# Altium schematic sheet Main_Scheet.SchDoc: Main sheet
size 420 x 297 mm; DocumentNumber: 2; SheetNumber: 2; SheetTotal: 8
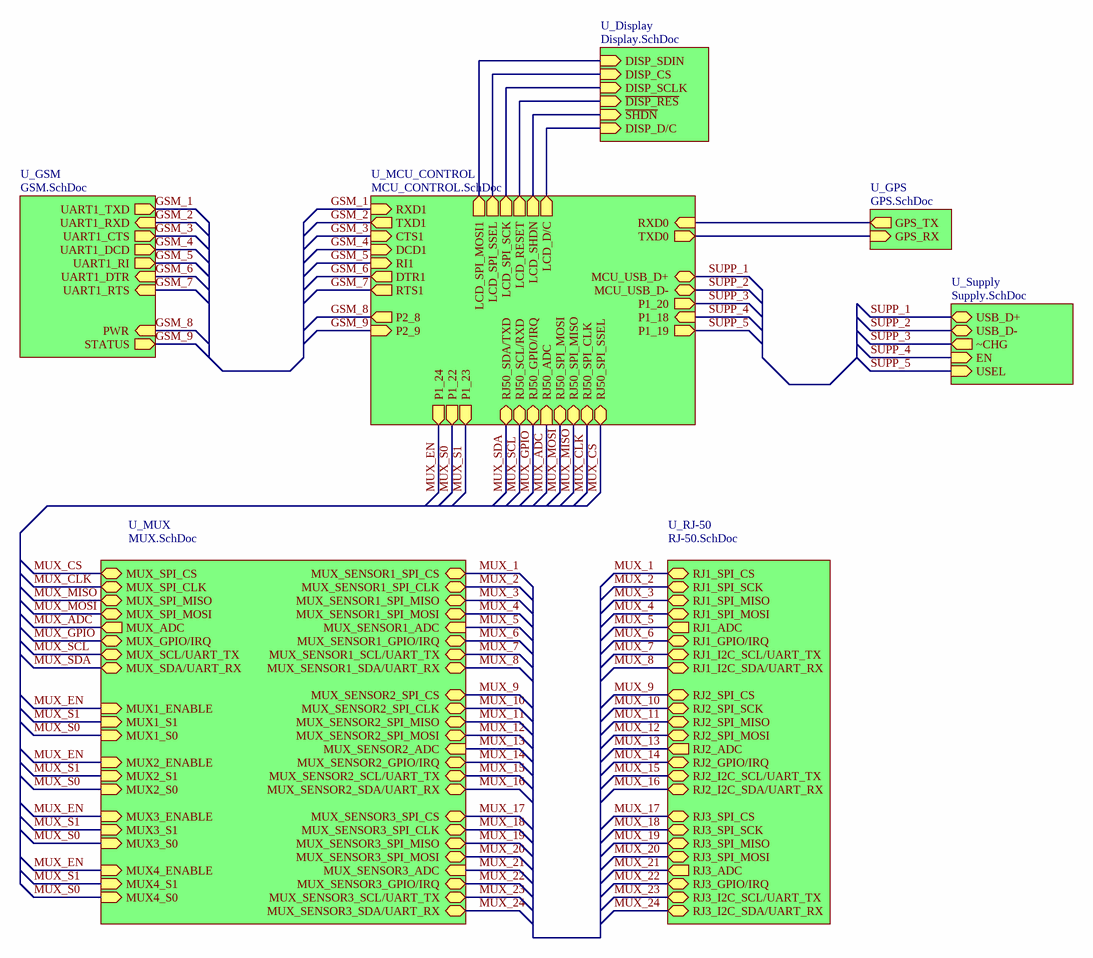
[diagram p0: Main_Scheet.SchDoc]

## Sub-sheets
U_Display = Display.SchDoc: ~{SHDN} (in), DISP_CS (in), ~{DISP_RES} (in), DISP_D/C (in), DISP_SCLK (in), DISP_SDIN (in)
U_GPS = GPS.SchDoc: GPS_RX (in), GPS_TX (out)
U_GSM = GSM.SchDoc: UART1_DCD (out), UART1_TXD (out), UART1_DTR (in), UART1_RI (out), UART1_RTS (in), UART1_RXD (in), UART1_CTS (out), STATUS (out), PWR (in)
U_MCU_CONTROL = MCU_CONTROL.SchDoc: TXD1 (out), RXD1 (in), CTS1 (in), DCD1 (in), DTR1 (out), RI1 (in), RTS1 (out), RXD0 (in), TXD0 (out), MCU_USB_D+ (bidir), MCU_USB_D- (bidir), P2_8 (out), RJ50_SPI_SSEL (bidir), P1_18 (in), P1_19 (out), P1_20 (out), RJ50_SCL/RXD (bidir), RJ50_SDA/TXD (bidir), RJ50_SPI_CLK (bidir), RJ50_SPI_MISO (bidir), RJ50_SPI_MOSI (bidir), RJ50_GPIO/IRQ (bidir), RJ50_ADC (in), P1_22 (out), P1_23 (out), P1_24 (out), P2_9 (in), LCD_D/C (out), LCD_RESET (out), LCD_SPI_SSEL (out), LCD_SPI_MOSI1 (out), LCD_SHDN (out), LCD_SPI_SCK (out)
U_MUX = MUX.SchDoc: MUX_SPI_CS (bidir), MUX_SENSOR1_SPI_CS (bidir), MUX_SENSOR2_SPI_CS (bidir), MUX_SENSOR3_SPI_CS (bidir), MUX_SENSOR1_SPI_CLK (bidir), MUX_SENSOR2_SPI_CLK (bidir), MUX_SENSOR3_SPI_CLK (bidir), MUX_SPI_CLK (bidir), MUX1_ENABLE (in), MUX1_S1 (in), MUX1_S0 (in), MUX_SPI_MISO (bidir), MUX_SENSOR1_SPI_MISO (bidir), MUX_SENSOR2_SPI_MISO (bidir), MUX_SENSOR3_SPI_MISO (bidir), MUX_SENSOR1_SPI_MOSI (bidir), MUX_SENSOR2_SPI_MOSI (bidir), MUX_SENSOR3_SPI_MOSI (bidir), MUX_SPI_MOSI (bidir), MUX2_ENABLE (in), MUX2_S1 (in), MUX2_S0 (in), MUX_ADC (out), MUX_SENSOR1_ADC (in), MUX_SENSOR2_ADC (in), MUX_SENSOR3_ADC (in), MUX_SENSOR1_GPIO/IRQ (bidir), MUX_SENSOR2_GPIO/IRQ (bidir), MUX_SENSOR3_GPIO/IRQ (bidir), MUX_GPIO/IRQ (bidir), MUX3_ENABLE (in), MUX3_S1 (in), MUX3_S0 (in), MUX_SCL/UART_TX (bidir), MUX_SENSOR1_SCL/UART_TX (bidir), MUX_SENSOR2_SCL/UART_TX (bidir), MUX_SENSOR3_SCL/UART_TX (bidir), MUX_SENSOR1_SDA/UART_RX (bidir), MUX_SENSOR2_SDA/UART_RX (bidir), MUX_SENSOR3_SDA/UART_RX (bidir), MUX_SDA/UART_RX (bidir), MUX4_ENABLE (in), MUX4_S1 (in), MUX4_S0 (in)
U_RJ-50 = RJ-50.SchDoc: RJ1_SPI_CS (bidir), RJ1_SPI_SCK (bidir), RJ1_SPI_MISO (bidir), RJ1_SPI_MOSI (bidir), RJ1_ADC (out), RJ1_I2C_SCL/UART_TX (bidir), RJ1_I2C_SDA/UART_RX (bidir), RJ1_GPIO/IRQ (bidir), RJ2_SPI_CS (bidir), RJ2_SPI_SCK (bidir), RJ2_SPI_MISO (bidir), RJ2_SPI_MOSI (bidir), RJ2_ADC (out), RJ2_I2C_SCL/UART_TX (bidir), RJ2_I2C_SDA/UART_RX (bidir), RJ2_GPIO/IRQ (bidir), RJ3_SPI_CS (bidir), RJ3_SPI_SCK (bidir), RJ3_SPI_MISO (bidir), RJ3_SPI_MOSI (bidir), RJ3_ADC (out), RJ3_I2C_SCL/UART_TX (bidir), RJ3_I2C_SDA/UART_RX (bidir), RJ3_GPIO/IRQ (bidir)
U_Supply = Supply.SchDoc: ~CHG (out), USEL (in), EN (in), USB_D- (bidir), USB_D+ (bidir)

## Nets
GSM_1: sheet U_MCU_CONTROL/RXD1, sheet U_GSM/UART1_TXD
GSM_2: sheet U_MCU_CONTROL/TXD1, sheet U_GSM/UART1_RXD
GSM_3: sheet U_MCU_CONTROL/CTS1, sheet U_GSM/UART1_CTS
GSM_4: sheet U_MCU_CONTROL/DCD1, sheet U_GSM/UART1_DCD
GSM_5: sheet U_MCU_CONTROL/RI1, sheet U_GSM/UART1_RI
GSM_6: sheet U_MCU_CONTROL/DTR1, sheet U_GSM/UART1_DTR
GSM_7: sheet U_MCU_CONTROL/RTS1, sheet U_GSM/UART1_RTS
GSM_8: sheet U_MCU_CONTROL/P2_8, sheet U_GSM/PWR
GSM_9: sheet U_MCU_CONTROL/P2_9, sheet U_GSM/STATUS
MUX_1: sheet U_RJ-50/RJ1_SPI_CS, sheet U_MUX/MUX_SENSOR1_SPI_CS
MUX_2: sheet U_RJ-50/RJ1_SPI_SCK, sheet U_MUX/MUX_SENSOR1_SPI_CLK
MUX_3: sheet U_RJ-50/RJ1_SPI_MISO, sheet U_MUX/MUX_SENSOR1_SPI_MISO
MUX_4: sheet U_RJ-50/RJ1_SPI_MOSI, sheet U_MUX/MUX_SENSOR1_SPI_MOSI
MUX_5: sheet U_RJ-50/RJ1_ADC, sheet U_MUX/MUX_SENSOR1_ADC
MUX_6: sheet U_RJ-50/RJ1_GPIO/IRQ, sheet U_MUX/MUX_SENSOR1_GPIO/IRQ
MUX_7: sheet U_RJ-50/RJ1_I2C_SCL/UART_TX, sheet U_MUX/MUX_SENSOR1_SCL/UART_TX
MUX_8: sheet U_RJ-50/RJ1_I2C_SDA/UART_RX, sheet U_MUX/MUX_SENSOR1_SDA/UART_RX
MUX_9: sheet U_RJ-50/RJ2_SPI_CS, sheet U_MUX/MUX_SENSOR2_SPI_CS
MUX_10: sheet U_RJ-50/RJ2_SPI_SCK, sheet U_MUX/MUX_SENSOR2_SPI_CLK
MUX_11: sheet U_RJ-50/RJ2_SPI_MISO, sheet U_MUX/MUX_SENSOR2_SPI_MISO
MUX_12: sheet U_RJ-50/RJ2_SPI_MOSI, sheet U_MUX/MUX_SENSOR2_SPI_MOSI
MUX_13: sheet U_RJ-50/RJ2_ADC, sheet U_MUX/MUX_SENSOR2_ADC
MUX_14: sheet U_RJ-50/RJ2_GPIO/IRQ, sheet U_MUX/MUX_SENSOR2_GPIO/IRQ
MUX_15: sheet U_RJ-50/RJ2_I2C_SCL/UART_TX, sheet U_MUX/MUX_SENSOR2_SCL/UART_TX
MUX_16: sheet U_RJ-50/RJ2_I2C_SDA/UART_RX, sheet U_MUX/MUX_SENSOR2_SDA/UART_RX
MUX_17: sheet U_RJ-50/RJ3_SPI_CS, sheet U_MUX/MUX_SENSOR3_SPI_CS
MUX_18: sheet U_RJ-50/RJ3_SPI_SCK, sheet U_MUX/MUX_SENSOR3_SPI_CLK
MUX_19: sheet U_RJ-50/RJ3_SPI_MISO, sheet U_MUX/MUX_SENSOR3_SPI_MISO
MUX_20: sheet U_RJ-50/RJ3_SPI_MOSI, sheet U_MUX/MUX_SENSOR3_SPI_MOSI
MUX_21: sheet U_RJ-50/RJ3_ADC, sheet U_MUX/MUX_SENSOR3_ADC
MUX_22: sheet U_RJ-50/RJ3_GPIO/IRQ, sheet U_MUX/MUX_SENSOR3_GPIO/IRQ
MUX_23: sheet U_RJ-50/RJ3_I2C_SCL/UART_TX, sheet U_MUX/MUX_SENSOR3_SCL/UART_TX
MUX_24: sheet U_RJ-50/RJ3_I2C_SDA/UART_RX, sheet U_MUX/MUX_SENSOR3_SDA/UART_RX
MUX_ADC: sheet U_MUX/MUX_ADC, sheet U_MCU_CONTROL/RJ50_ADC
MUX_CLK: sheet U_MUX/MUX_SPI_CLK, sheet U_MCU_CONTROL/RJ50_SPI_CLK
MUX_CS: sheet U_MUX/MUX_SPI_CS, sheet U_MCU_CONTROL/RJ50_SPI_SSEL
MUX_EN: sheet U_MUX/MUX1_ENABLE, sheet U_MUX/MUX2_ENABLE, sheet U_MUX/MUX3_ENABLE, sheet U_MUX/MUX4_ENABLE, sheet U_MCU_CONTROL/P1_24
MUX_GPIO: sheet U_MUX/MUX_GPIO/IRQ, sheet U_MCU_CONTROL/RJ50_GPIO/IRQ
MUX_MISO: sheet U_MUX/MUX_SPI_MISO, sheet U_MCU_CONTROL/RJ50_SPI_MISO
MUX_MOSI: sheet U_MUX/MUX_SPI_MOSI, sheet U_MCU_CONTROL/RJ50_SPI_MOSI
MUX_S0: sheet U_MUX/MUX1_S0, sheet U_MUX/MUX2_S0, sheet U_MUX/MUX3_S0, sheet U_MUX/MUX4_S0, sheet U_MCU_CONTROL/P1_22
MUX_S1: sheet U_MUX/MUX1_S1, sheet U_MUX/MUX2_S1, sheet U_MUX/MUX3_S1, sheet U_MUX/MUX4_S1, sheet U_MCU_CONTROL/P1_23
MUX_SCL: sheet U_MUX/MUX_SCL/UART_TX, sheet U_MCU_CONTROL/RJ50_SCL/RXD
MUX_SDA: sheet U_MUX/MUX_SDA/UART_RX, sheet U_MCU_CONTROL/RJ50_SDA/TXD
SUPP_1: sheet U_Supply/USB_D+, sheet U_MCU_CONTROL/MCU_USB_D+
SUPP_2: sheet U_Supply/USB_D-, sheet U_MCU_CONTROL/MCU_USB_D-
SUPP_3: sheet U_Supply/~CHG, sheet U_MCU_CONTROL/P1_20
SUPP_4: sheet U_Supply/EN, sheet U_MCU_CONTROL/P1_18
SUPP_5: sheet U_Supply/USEL, sheet U_MCU_CONTROL/P1_19
(unnamed): sheet U_MCU_CONTROL/RXD0, sheet U_GPS/GPS_TX
(unnamed): sheet U_MCU_CONTROL/TXD0, sheet U_GPS/GPS_RX
(unnamed): sheet U_MCU_CONTROL/LCD_D/C, sheet U_Display/DISP_D/C
(unnamed): sheet U_MCU_CONTROL/LCD_RESET, sheet U_Display/~{DISP_RES}
(unnamed): sheet U_MCU_CONTROL/LCD_SPI_SSEL, sheet U_Display/DISP_CS
(unnamed): sheet U_MCU_CONTROL/LCD_SPI_MOSI1, sheet U_Display/DISP_SDIN
(unnamed): sheet U_MCU_CONTROL/LCD_SHDN, sheet U_Display/~{SHDN}
(unnamed): sheet U_MCU_CONTROL/LCD_SPI_SCK, sheet U_Display/DISP_SCLK

## Notes on the sheet
- Project/Equipment
- Document
- Sensorbox
- Designer
- Drawn by
- Check.by
- Copyright Creotech Instruments SA 2014.
  This documentation describes Open Hardware and is licensed under the CERN OHL v.1.1. You may redistribute and modify this documentation under the terms of the CERN OHL v.1.1. (http://ohwr.org/CERNOHL). This documentation is distributed WITHOUT ANY EXPRESS OR IMPLIED WARRANTY, INCLUDING OF MERCHANTABILITY, SATISFACTORY QUALITY AND FITNESS FOR A PARTICULAR PURPOSE. Please see the CERN OHL v.1.1 for applicable conditions.
- CTI
- Creotech Instruments S.A.
- File
- Last Mod.
- Print Date
- Sheet
- Size
- A3
- of
- Rev